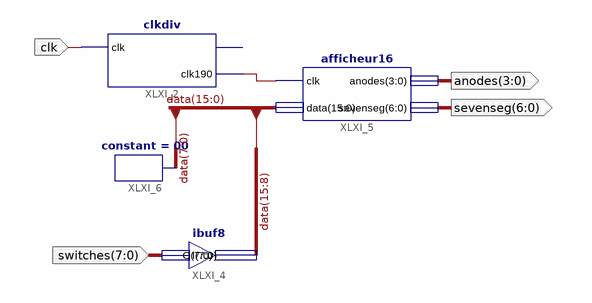
[diagram p0: schematic sheet 1]
// Xilinx ISE schematic toplevel.sch (spartan3e) as structural Verilog: 4 symbols, 4 ports
module toplevel (
  input  clk,
  input  [7:0] switches,
  output [6:0] sevenseg,
  output [3:0] anodes
);

  wire XLXN_11;
  wire [15:0] data;

  clkdiv XLXI_2 (.clk(clk), .clk190(XLXN_11));  // open: clksec
  ibuf8 XLXI_4 (.I(switches), .O(data[15:8]));
  afficheur16 XLXI_5 (.clk(XLXN_11), .data(data), .anodes(anodes), .sevenseg(sevenseg));
  constant #(.CValue("00")) XLXI_6 (.O(data[7:0]));
endmodule
